# Altium schematic sheet base_tiempo.SchDoc: Base de tiempo
size A4; Revision: 1
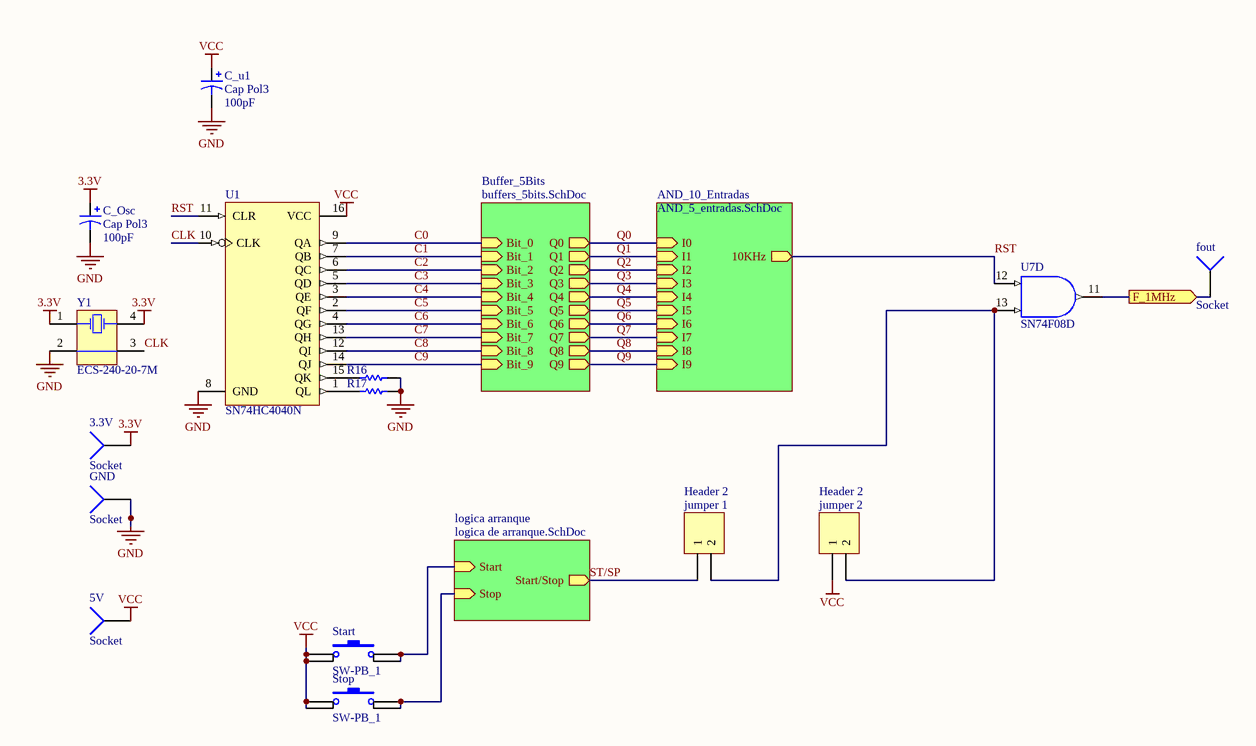
[diagram p0: base_tiempo.SchDoc]

## Parts
3.3V  Socket  [PIN1]
5V  Socket  [PIN1]
C_Osc  Cap Pol3  value 100pF  [C0805]
C_u1  Cap Pol3  value 100pF  [C0805]
fout  Socket  [PIN1]
GND  Socket  [PIN1]
jumper_1  Header 2  [HDR1X2]
jumper_2  Header 2  [HDR1X2]
R16  Res Semi  [2012[0805]]  (value not drawn)
R17  Res Semi  [2012[0805]]  (value not drawn)
Start  SW-PB_1  [SPST-44]
Stop  SW-PB_1  [SPST-44]
U1  SN74HC4040N  [N016]
U7  SN74F08D  [D014_N]  (part D of 4)
Y1  ECS-240-20-7M  [ECX-3M]

## Sub-sheets
AND_10_Entradas = AND_5_entradas.SchDoc: I0 (in), I1 (in), I2 (in), I3 (in), I4 (in), 10KHz (out), I5 (in), I6 (in), I7 (in), I8 (in), I9 (in)
Buffer_5Bits = buffers_5bits.SchDoc: Bit_0 (in), Bit_1 (in), Bit_2 (in), Bit_3 (in), Bit_4 (in), Q0 (out), Q1 (out), Q2 (out), Q3 (out), Q4 (out), Bit_5 (in), Bit_6 (in), Bit_7 (in), Bit_8 (in), Bit_9 (in), Q5 (out), Q6 (out), Q7 (out), Q8 (out), Q9 (out)
logica arranque = logica de arranque.SchDoc: Start (in), Stop (in), Start/Stop (out)

## Ports
F_1MHz (out)

## Nets
3.3V: 3.3V.1 C_Osc.1 Y1.1(OSC1) Y1.4(OSC2)
GND: C_Osc.2 C_u1.2 GND.1 R16.2 R17.2 U1.8(GND) U7.7(GND) Y1.2(COM)
VCC: 5V.1 C_u1.1 jumper_2.1 Start.1 Start.3 Stop.1 Stop.3 U1.16(VCC) U7.14(VCC)
C0: U1.9(QA) ; sheet Buffer_5Bits/Bit_0
C1: U1.7(QB) ; sheet Buffer_5Bits/Bit_1
C2: U1.6(QC) ; sheet Buffer_5Bits/Bit_2
C3: U1.5(QD) ; sheet Buffer_5Bits/Bit_3
C4: U1.3(QE) ; sheet Buffer_5Bits/Bit_4
C5: U1.2(QF) ; sheet Buffer_5Bits/Bit_5
C6: U1.4(QG) ; sheet Buffer_5Bits/Bit_6
C7: U1.13(QH) ; sheet Buffer_5Bits/Bit_7
C8: U1.12(QI) ; sheet Buffer_5Bits/Bit_8
C9: U1.14(QJ) ; sheet Buffer_5Bits/Bit_9
CLK: U1.10(CLK) Y1.3(COM)
F_1MHz: fout.1 U7.11(Y) ; port F_1MHz
Q0: sheet Buffer_5Bits/Q0, sheet AND_10_Entradas/I0
Q1: sheet Buffer_5Bits/Q1, sheet AND_10_Entradas/I1
Q2: sheet Buffer_5Bits/Q2, sheet AND_10_Entradas/I2
Q3: sheet Buffer_5Bits/Q3, sheet AND_10_Entradas/I3
Q4: sheet Buffer_5Bits/Q4, sheet AND_10_Entradas/I4
Q5: sheet Buffer_5Bits/Q5, sheet AND_10_Entradas/I5
Q6: sheet Buffer_5Bits/Q6, sheet AND_10_Entradas/I6
Q7: sheet Buffer_5Bits/Q7, sheet AND_10_Entradas/I7
Q8: sheet Buffer_5Bits/Q8, sheet AND_10_Entradas/I8
Q9: sheet Buffer_5Bits/Q9, sheet AND_10_Entradas/I9
RST: U1.11(CLR) U7.12(A) ; sheet AND_10_Entradas/10KHz
ST/SP: jumper_1.1 ; sheet logica arranque/Start/Stop
Netjumper_1_2: jumper_1.2 jumper_2.2 U7.13(B)
NetR16_1: R16.1 U1.15(QK)
NetR17_1: R17.1 U1.1(QL)
NetStart_2: Start.2 Start.4 ; sheet logica arranque/Start
NetStop_2: Stop.2 Stop.4 ; sheet logica arranque/Stop

## Library data of the parts
C_Osc C_u1 = Cap Pol3: Polarized Capacitor (Surface Mount); Published: 8-Jun-2000; LatestRevisionDate: 17-Jul-2002; LatestRevisionNote: Re-released for DXP Platform.; PackageReference: C0805; Publisher: Altium Limited
jumper_1 jumper_2 = Header 2: Header, 2-Pin; LatestRevisionDate: 17-Jul-2002; LatestRevisionNote: Re-released for DXP Platform.; Publisher: Altium Limited
R16 R17 = Res Semi: Semiconductor Resistor; Value: 1K; Published: 8-Jun-2000; LatestRevisionDate: 17-Jul-2002; LatestRevisionNote: Re-released for DXP Platform.; PackageReference: AXIAL-0.5; Publisher: Altium Limited
Start Stop = SW-PB_1: Switch; Published: 24-Mar-1999; LatestRevisionDate: 17-Jul-2002; LatestRevisionNote: Re-released for DXP Platform.; PackageReference: SPST-2; Publisher: Altium Limited
U1 = SN74HC4040N: 12-Bit Asynchronous Binary Counter; Published: 8-Jun-2000; LatestRevisionDate: 04-Mar-2005; LatestRevisionNote: Stylized 3D Model Added.; DatasheetVersion: May-1997; PackageVersion: Oct-1995; PackageReference: N016; Publisher: Altium Limited; PackageDescription: DIP; 16 Leads; Row Spacing 7.62 mm; Pitch 2.54 mm; Code_JEDEC: MS-001-BB; ComponentLink1Description: Manufacturer Link; ComponentLink1URL: http://www.ti.com/; ComponentLink2Description: Datasheet; ComponentLink2URL: http://www-s.ti.com/sc/ds/sn74hc4040.pdf
U7 = SN74F08D: Quadruple 2-Input Positive-AND Gate; Published: 8-Jun-2000; LatestRevisionDate: 13-Apr-2006; LatestRevisionNote: IPC-7351 Footprint Added.; DatasheetVersion: Oct-1993; PackageVersion: Jan-1998; PackageReference: D014; Publisher: Altium Limited; PackageDescription: 14-Pin Small Outline Integrated Circuit 1.27 mm Pitch; Code_IPC: SOIC127P600-14; ComponentLink1Description: Manufacturer Link; ComponentLink1URL: http://www.ti.com/; ComponentLink2Description: Datasheet; ComponentLink2URL: http://www-s.ti.com/sc/ds/SN74F08.pdf
Y1 = ECS-240-20-7M: Crystal Oscillator; Published: 17-Jul-2002; DatasheetDocument: 18-Apr-2000; PackageReference: ECX-3M; Publisher: Altium Limited; ComponentLink1Description: Manufacturer Link; ComponentLink1URL: http://www.ecsxtal.com/
3.3V 5V fout GND = Socket: LatestRevisionDate: 17-Jul-2002; LatestRevisionNote: Re-released for DXP Platform.; Publisher: Altium Limited